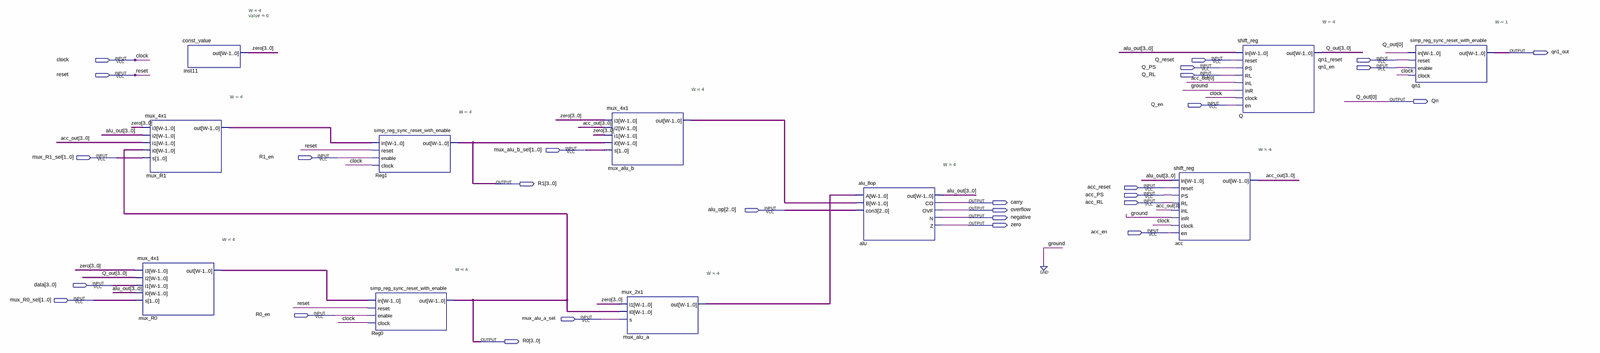
[diagram p0: schematic sheet, whole]
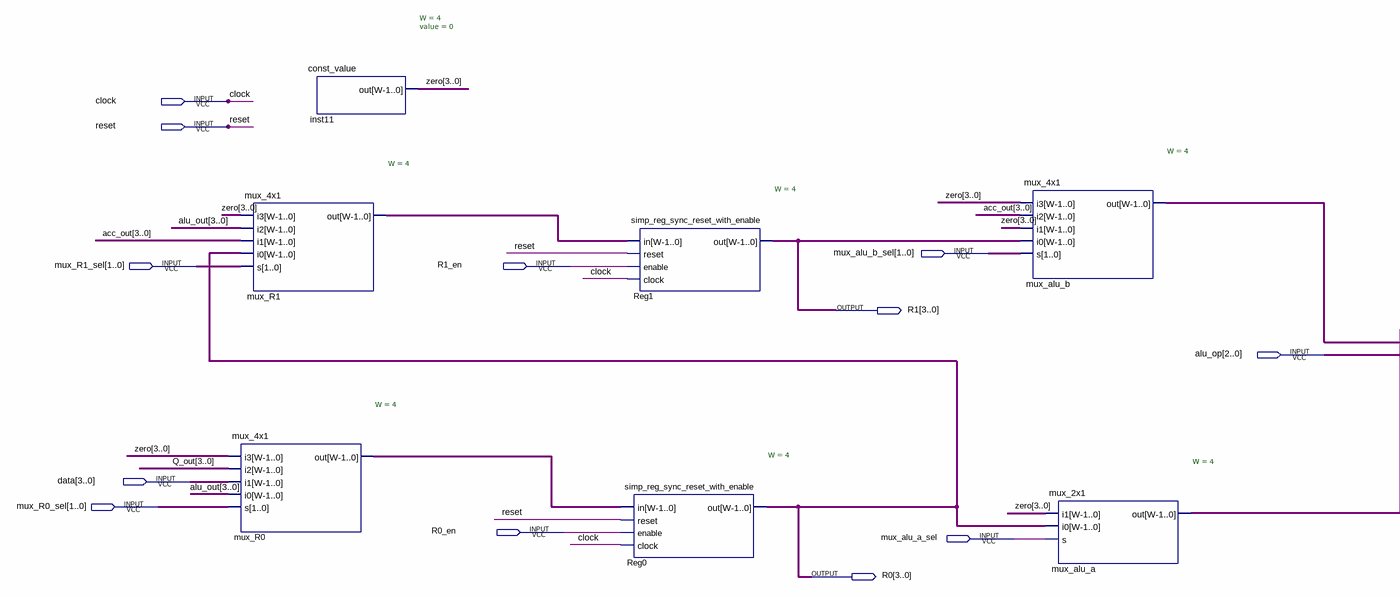
[diagram p1: schematic sheet, left part]
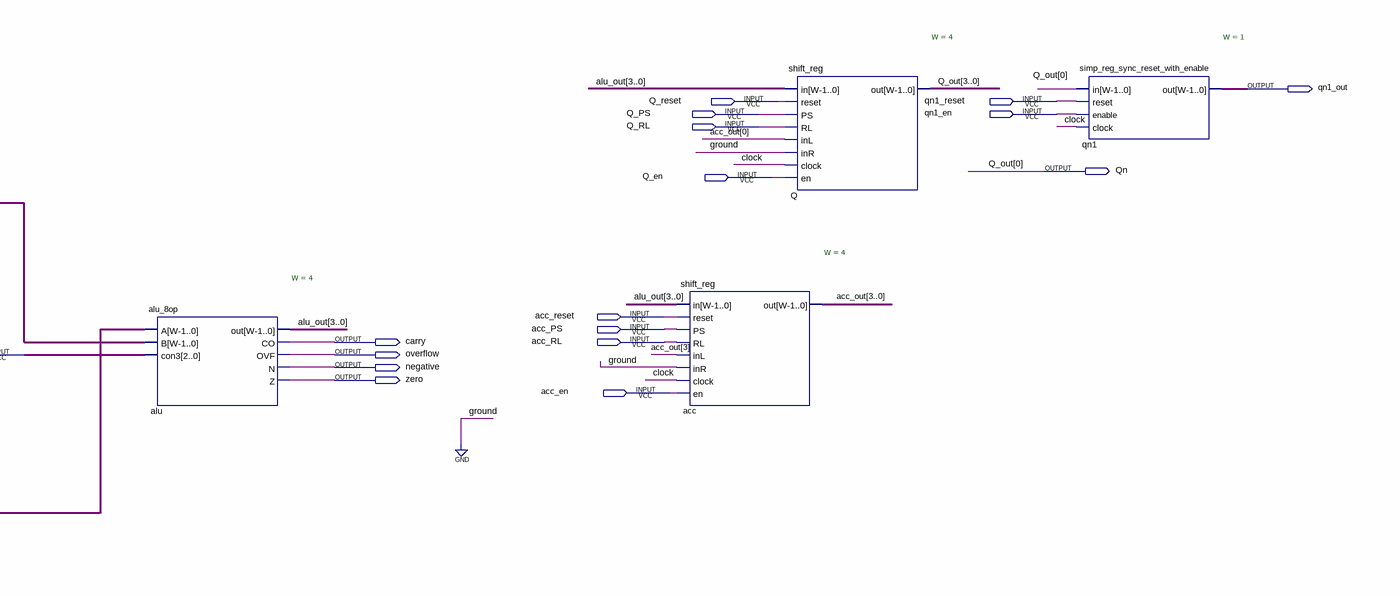
[diagram p2: schematic sheet, right part]
// Quartus schematic datapath.bdf as structural Verilog: 11 symbols, 28 pins
module datapath (
  input  clock,
  input  Q_reset,
  input  qn1_reset,
  input  Q_PS,
  input  qn1_en,
  input  reset,
  input  Q_RL,
  input  Q_en,
  input  [1:0] mux_alu_b_sel,
  input  [1:0] mux_R1_sel,
  input  R1_en,
  input  acc_reset,
  input  acc_PS,
  input  acc_RL,
  input  [2:0] alu_op,
  input  acc_en,
  input  [3:0] data,
  input  [1:0] mux_R0_sel,
  input  R0_en,
  input  mux_alu_a_sel,
  output qn1_out,
  output Qn,
  output [3:0] R1,
  output carry,
  output overflow,
  output negative,
  output zero,
  output [3:0] R0
);

  wire [3:0] acc_out, alu_out, mux_alu_a_out, mux_alu_b_out, mux_R0_out, mux_R1_out, zero_bus;
  wire [3:1] Q_out;

  mux_4x1 #(.W(4)) mux_R1 (.i3(zero_bus), .i2(alu_out), .i1(acc_out), .i0(R0), .s(mux_R1_sel), .out(mux_R1_out));
  mux_4x1 #(.W(4)) mux_R0 (.i3(zero_bus), .i2({Q_out, Qn}), .i1(data), .i0(alu_out), .s(mux_R0_sel), .out(mux_R0_out));
  const_value #(.W(4), .value(0)) inst11 (.out(zero_bus));
  simp_reg_sync_reset_with_enable #(.W(4)) Reg0 (
    .in(mux_R0_out), .reset(reset), .enable(R0_en), .clock(clock), .out(R0));
  simp_reg_sync_reset_with_enable #(.W(4)) Reg1 (
    .in(mux_R1_out), .reset(reset), .enable(R1_en), .clock(clock), .out(R1));
  mux_4x1 #(.W(4)) mux_alu_b (
    .i3(zero_bus), .i2(acc_out), .i1(zero_bus), .i0(R1), .s(mux_alu_b_sel), .out(mux_alu_b_out));
  mux_2x1 #(.W(4)) mux_alu_a (.i1(zero_bus), .i0(R0), .s(mux_alu_a_sel), .out(mux_alu_a_out));
  alu_8op #(.W(4)) alu (
    .A(mux_alu_a_out), .B(mux_alu_b_out), .con3(alu_op), .out(alu_out), .CO(carry), .OVF(overflow),
    .N(negative), .Z(zero));
  shift_reg #(.W(4)) acc (
    .in(alu_out), .reset(acc_reset), .PS(acc_PS), .RL(acc_RL), .inL(acc_out[3]), .inR(1'b0), .clock(clock),
    .en(acc_en), .out(acc_out));
  shift_reg #(.W(4)) Q (
    .in(alu_out), .reset(Q_reset), .PS(Q_PS), .RL(Q_RL), .inL(acc_out[0]), .inR(1'b0), .clock(clock),
    .en(Q_en), .out({Q_out, Qn}));
  simp_reg_sync_reset_with_enable #(.W(1)) qn1 (
    .in(Qn), .reset(qn1_reset), .enable(qn1_en), .clock(clock), .out(qn1_out));

  // Other names for the same wires on the sheet: Q_out[0] = Qn
endmodule
